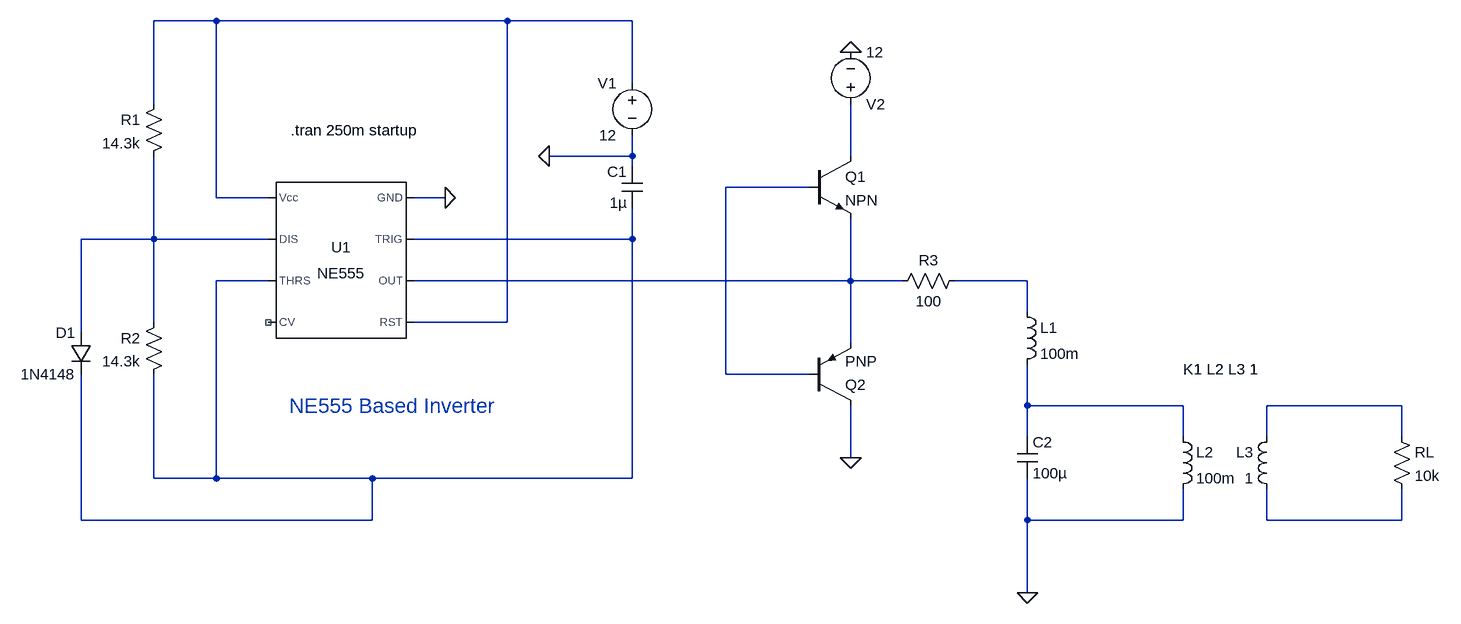
[diagram p0: schematic NE555_Inductor.asc]
NE555_Inductor.asc, the LTspice schematic file:
Version 4.1
SHEET 1 2020 680
WIRE -112 -272 -208 -272
WIRE 336 -272 -112 -272
WIRE 528 -272 336 -272
WIRE 528 -176 528 -272
WIRE -208 -144 -208 -272
WIRE 528 -64 528 -96
WIRE 528 -64 400 -64
WIRE 864 -64 864 -144
WIRE 528 -48 528 -64
WIRE 800 -16 672 -16
WIRE -112 0 -112 -272
WIRE -32 0 -112 0
WIRE 240 0 192 0
WIRE -208 64 -208 -64
WIRE -208 64 -320 64
WIRE -32 64 -208 64
WIRE 528 64 528 16
WIRE 528 64 192 64
WIRE -32 128 -112 128
WIRE 864 128 864 32
WIRE 864 128 192 128
WIRE 944 128 864 128
WIRE 1136 128 1024 128
WIRE 1136 176 1136 128
WIRE -208 192 -208 64
WIRE 336 192 336 -272
WIRE 336 192 192 192
WIRE -320 208 -320 64
WIRE 864 224 864 128
WIRE 672 272 672 -16
WIRE 800 272 672 272
WIRE 1136 320 1136 256
WIRE 1376 320 1136 320
WIRE 1712 320 1504 320
WIRE 1136 368 1136 320
WIRE 1376 368 1376 320
WIRE 1504 368 1504 320
WIRE 1712 368 1712 320
WIRE 864 400 864 320
WIRE -208 432 -208 272
WIRE -112 432 -112 128
WIRE -112 432 -208 432
WIRE 128 432 -112 432
WIRE 528 432 528 64
WIRE 528 432 128 432
WIRE -320 496 -320 272
WIRE 128 496 128 432
WIRE 128 496 -320 496
WIRE 1136 496 1136 432
WIRE 1376 496 1376 448
WIRE 1376 496 1136 496
WIRE 1504 496 1504 448
WIRE 1712 496 1712 448
WIRE 1712 496 1504 496
WIRE 1136 608 1136 496
FLAG 240 0 0
FLAG 400 -64 0
FLAG 864 400 0
FLAG 864 -224 0
FLAG 1136 608 0
SYMBOL Misc\\NE555 80 96 M0
SYMATTR InstName U1
SYMBOL voltage 528 -192 M0
WINDOW 123 0 0 Left 0
WINDOW 39 0 0 Left 0
SYMATTR InstName V1
SYMATTR Value 12
SYMBOL cap 544 -48 M0
SYMATTR InstName C1
SYMATTR Value 1µ
SYMBOL res -192 -160 M0
SYMATTR InstName R1
SYMATTR Value 14.3k
SYMBOL res -192 176 M0
SYMATTR InstName R2
SYMATTR Value 14.3k
SYMBOL diode -304 208 M0
SYMATTR InstName D1
SYMATTR Value 1N4148
SYMBOL npn 800 -64 R0
SYMATTR InstName Q1
SYMBOL pnp 800 320 M180
SYMATTR InstName Q2
SYMBOL voltage 864 -128 M180
WINDOW 123 0 0 Left 0
WINDOW 39 0 0 Left 0
SYMATTR InstName V2
SYMATTR Value 12
SYMBOL res 1040 112 R90
WINDOW 0 0 56 VBottom 2
WINDOW 3 32 56 VTop 2
SYMATTR InstName R3
SYMATTR Value 100
SYMBOL ind 1120 160 R0
SYMATTR InstName L1
SYMATTR Value 100m
SYMATTR SpiceLine Rser=1m
SYMBOL cap 1120 368 R0
SYMATTR InstName C2
SYMATTR Value 100µ
SYMBOL ind 1360 352 R0
SYMATTR InstName L2
SYMATTR Value 100m
SYMATTR Type ind
SYMATTR SpiceLine Rser=1m
SYMBOL ind 1520 352 M0
SYMATTR InstName L3
SYMATTR Value 1
SYMATTR Type ind
SYMATTR SpiceLine Rser=1m
SYMBOL res 1696 352 R0
SYMATTR InstName RL
SYMATTR Value 10k
TEXT 200 -104 Right 2 !.tran 250m startup
TEXT 1376 264 Left 2 !K1 L2 L3 1
TEXT 0 320 Left 3 ;NE555 Based Inverter

The netlist it stands for:
* NE555_Inductor.asc
X§U1 0 N005 N006 N001 NC_01 N005 N004 N001 NE555  ; pins GND TRIG OUT RST CV THRS DIS Vcc
V1 N001 0 12
C1 0 N005 1µ
R1 N001 N004 14.3k
R2 N004 N005 14.3k
D1 N004 N005 1N4148
Q1 N002 N003 N006 0 NPN
Q2 0 N003 N006 0 PNP
V2 N002 0 12
R3 N007 N006 100
L1 N007 N008 100m Rser=1m
C2 N008 0 100µ
L2 N008 0 100m Rser=1m
L3 N009 N010 1 Rser=1m
RL N009 N010 10k
.model D D
.lib standard.dio
.model NPN NPN
.model PNP PNP
.lib standard.bjt
.tran 250m startup
K1 L2 L3 1
* NE555 Based Inverter
.lib NE555.sub
.backanno
.end